# EAGLE design BLE112 Breakout Board v1.0 (EAGLE 5.11)
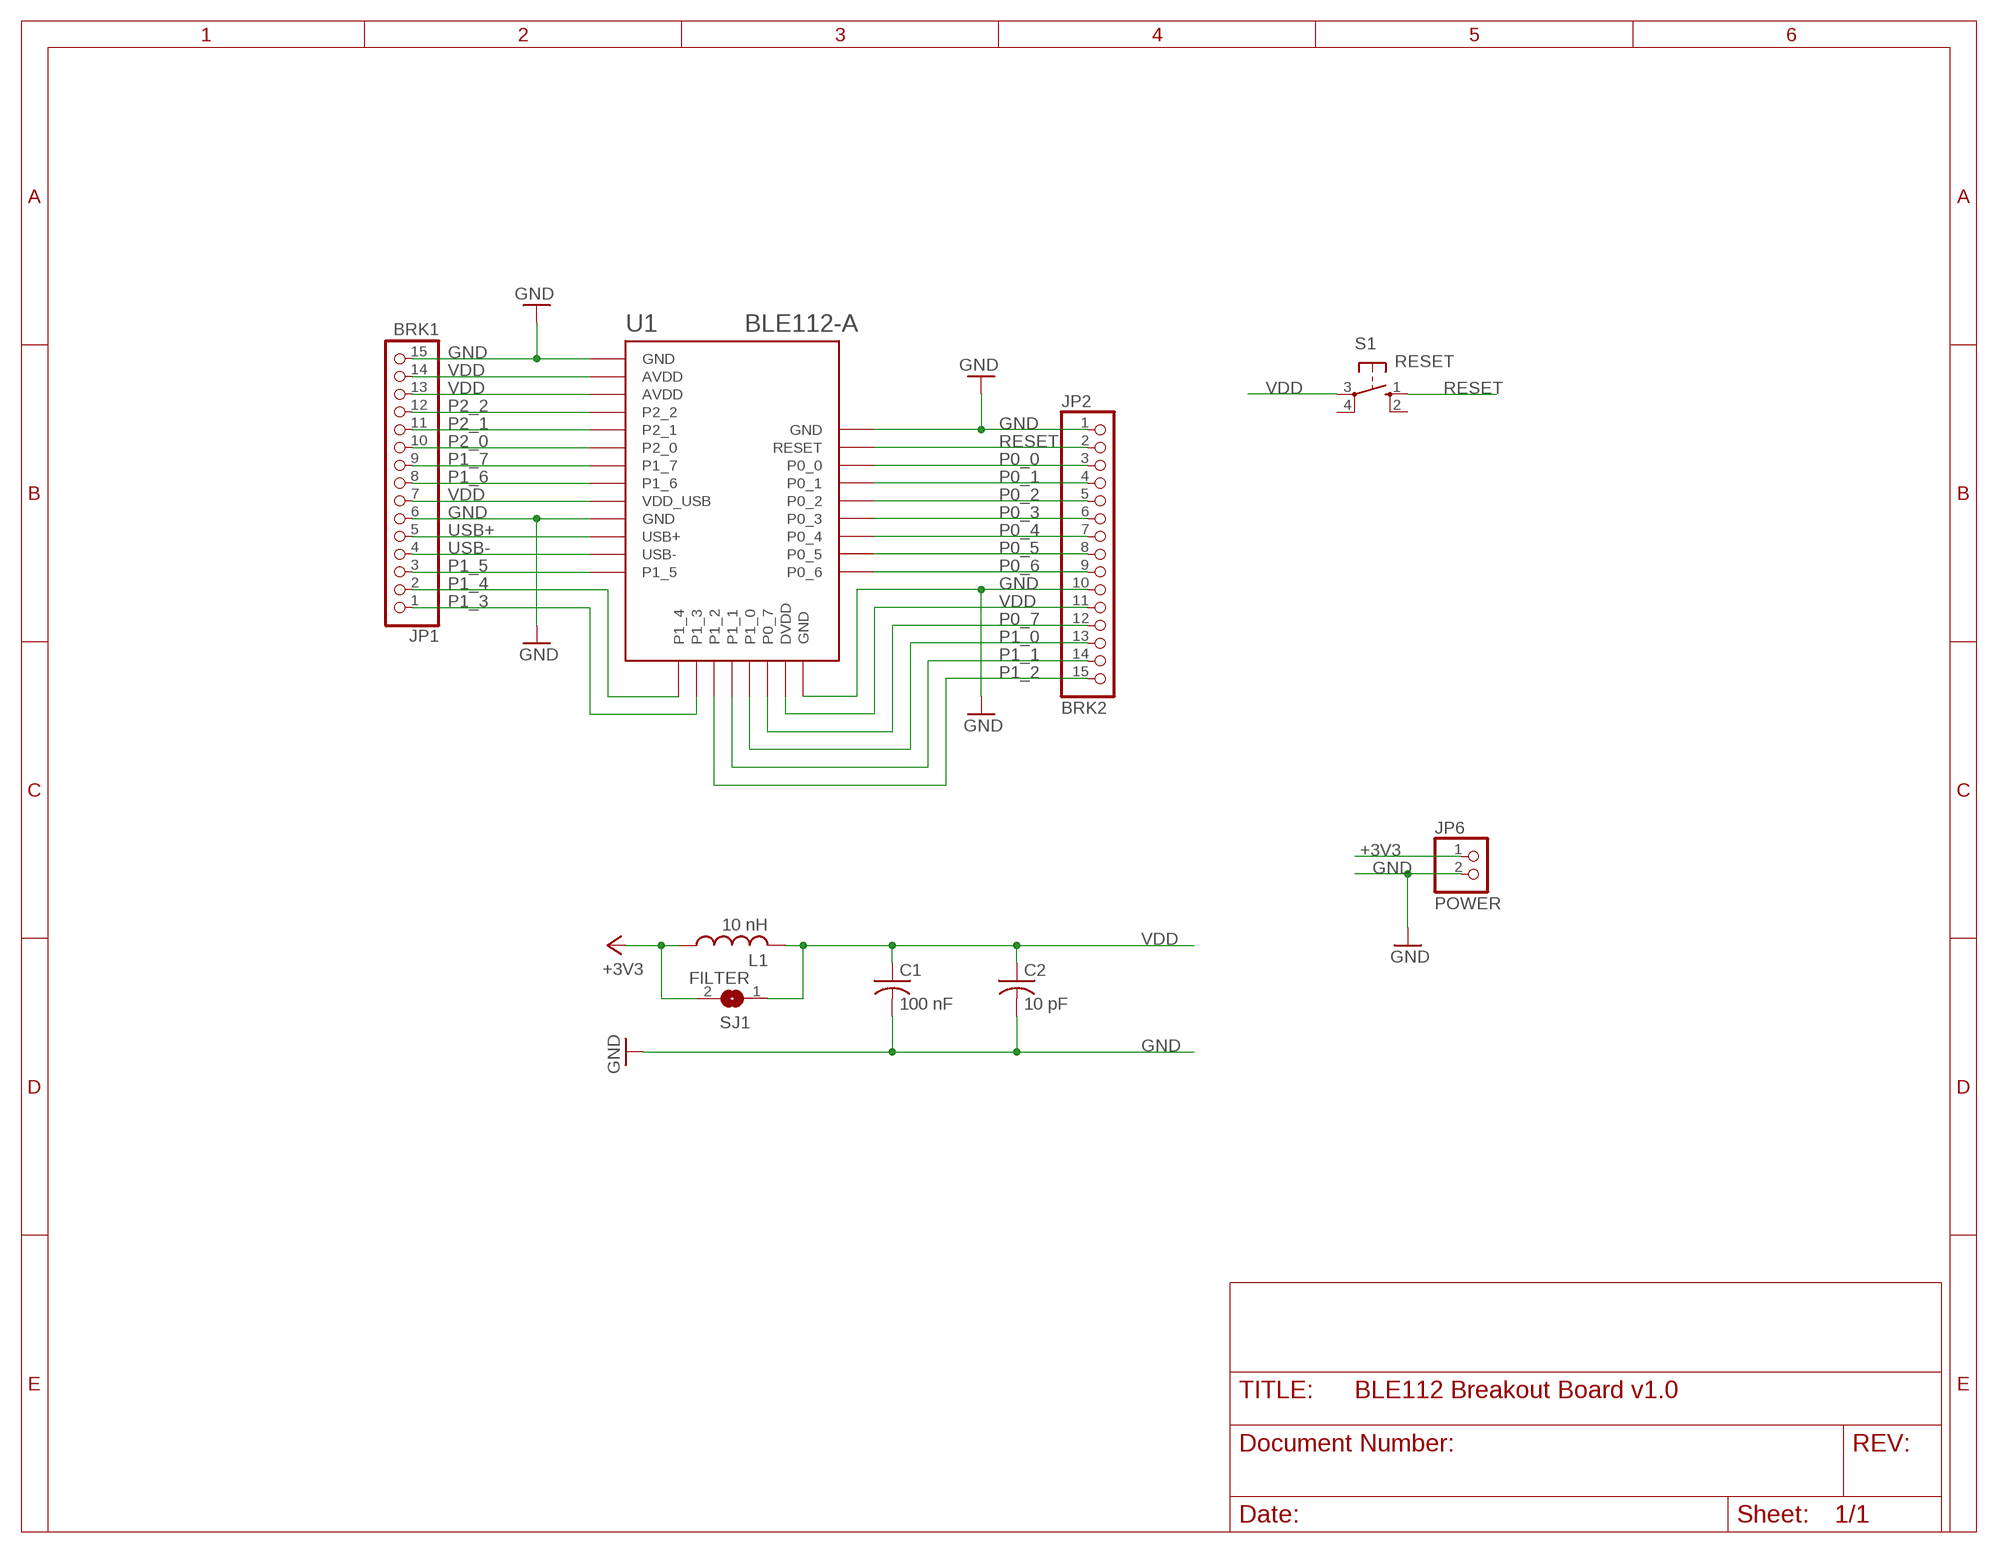
[diagram p0: schematic, sheet 1]

## Parts
C1  100 nF  C-US025-025X050  [C025-025X050]
C2  10 pF  C-US025-025X050  [C025-025X050]
JP1  BRK1  PINHD-1X15  [1X15]
JP2  BRK2  PINHD-1X15  [1X15]
JP6  POWER  PINHD-1X2  [1X02]
L1  10 nH  L-US0204/7  [0204/7]
S1  RESET  10-XX  [B3F-10XX]
SJ1  FILTER  SJ  [SJ]
U1  BLE112-A  BLE112-A-VISUAL  [BLE112-A]

## Nets
+3V3: JP6.1 L1.1 SJ1.2
GND: C1.2 C2.2 JP1.6 JP1.15 JP2.1 JP2.10 JP6.2 U1.GND1(GND) U1.GND2(GND) U1.GND3(GND) U1.GND4(GND)
P0_0: JP2.3 U1.P0_0
P0_1: JP2.4 U1.P0_1
P0_2: JP2.5 U1.P0_2
P0_3: JP2.6 U1.P0_3
P0_4: JP2.7 U1.P0_4
P0_5: JP2.8 U1.P0_5
P0_6: JP2.9 U1.P0_6
P0_7: JP2.12 U1.P0_7
P1_0: JP2.13 U1.P1_0
P1_1: JP2.14 U1.P1_1
P1_2: JP2.15 U1.P1_2
P1_3: JP1.1 U1.P1_3
P1_4: JP1.2 U1.P1_4
P1_5: JP1.3 U1.P1_5
P1_6: JP1.8 U1.P1_6
P1_7: JP1.9 U1.P1_7
P2_0: JP1.10 U1.P2_0
P2_1: JP1.11 U1.P2_1
P2_2: JP1.12 U1.P2_2
RESET: JP2.2 S1.1(S) U1.RESET
USB+: JP1.5 U1.USB+
USB-: JP1.4 U1.USB-
VDD: C1.1 C2.1 JP1.7 JP1.13 JP1.14 JP2.11 L1.2 S1.3(P) SJ1.1 U1.AVDD1(AVDD) U1.AVDD2(AVDD) U1.DVDD U1.VDD_USB
Unconnected: S1.2(S1) S1.4(P1)

## Library data of the parts
C1 C2 = resistor:C-US: CAPACITOR, American symbol
JP1 JP2 = sf-pinhead:PINHD-1X15: PIN HEADER
JP6 = sf-pinhead:PINHD-1X2: PIN HEADER
L1 = resistor:L-US: INDUCTOR, American symbol
S1 = switch-omron:10-XX: OMRON SWITCH; MPN: B3F-1000; OC_FARNELL: 176432; OC_NEWARK: 36M3542
SJ1 = jumper:SJ: SMD solder JUMPER
U1 = sf-bluegiga:BLE112-A-VISUAL: Bluetooth Low Energy single-mode module - Bluetooth 4.0, chip antenna

## Net classes
0 default: width 0.254 mm, drill 0.508 mm, clearance 0.254 mm

## Board
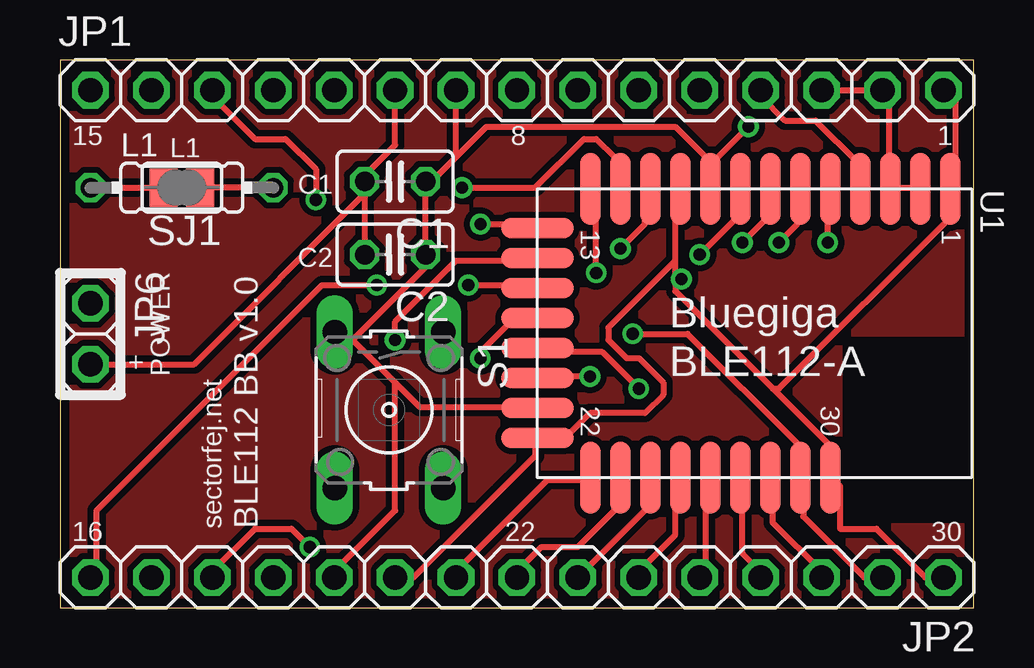
[diagram p1: board, top side]
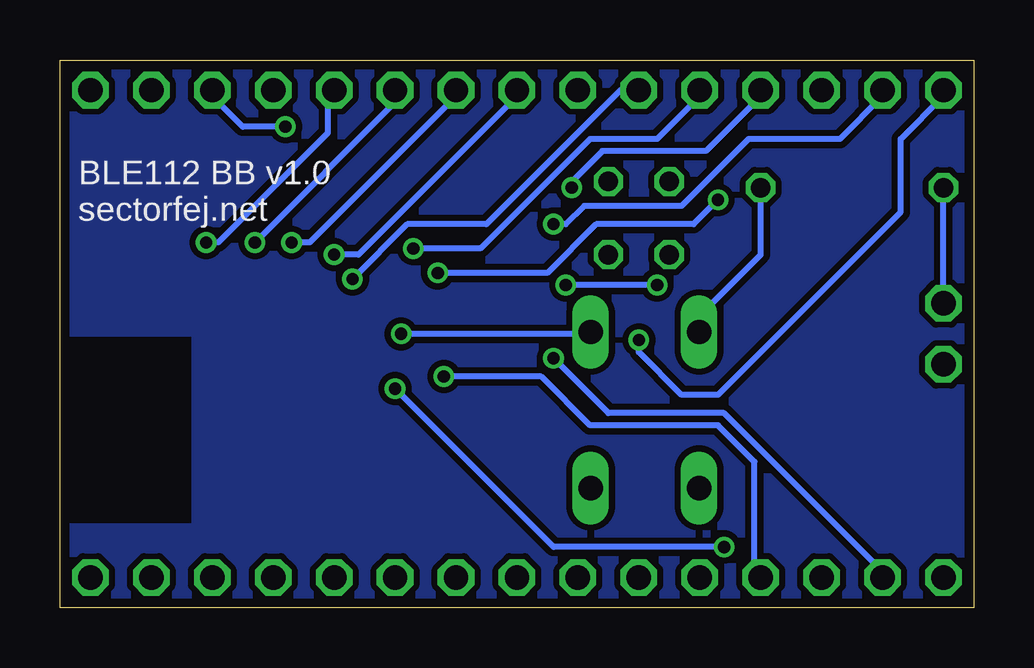
[diagram p2: board, bottom side, seen from below]

Size 38.1 x 22.85 mm. Coordinates in mm from the lower left corner, seen from the top.
Outline: 0,0 38.1,0 38.1,22.85 0,22.85 0,0
Copper layers (1*16): Top 0.0356mm / dielectric 1.5011mm / Bottom 0.0356mm
Design rules "LaenPCBOrder": minimum track width 6mil, minimum drill 13mil, track to track 6mil, track to pad 6mil, pad to pad 6mil, via to via 6mil, smd to smd 6mil, copper to edge 15mil, drill to drill 6mil, minimum pad ring 7mil, minimum via ring 7mil, stop-mask expansion 4mil, vias tented up to drill 0mil, thermal gap 10mil
tRestrict: area 32.6,3.6 to 38.1,11.3
bRestrict: area 32.6,3.6 to 38.1,11.3

### Footprints (pad centres in the part's own frame; a part is rotated, then mirrored left to right if it is on the bottom)
C025-025X050 = drill 0.813 octagon: 1 -1.27,0; 2 1.27,0
1X15 = drill 1.016 octagon: 1 -17.78,0; 2 -15.24,0; 3 -12.7,0; 4 -10.16,0; 5 -7.62,0; 6 -5.08,0; 7 -2.54,0; 8 0,0; 9 2.54,0; 10 5.08,0; 11 7.62,0; 12 10.16,0; 13 12.7,0; 14 15.24,0; 15 17.78,0
1X02 = drill 1.016 octagon: 1 -1.27,0; 2 1.27,0
0204/7 = drill 0.813 octagon: 1 -3.81,0; 2 3.81,0
B3F-10XX = drill 1.016 long: 1 -3.251,2.261; 2 3.251,2.261; 3 -3.251,-2.261; 4 3.251,-2.261
SJ = smd 1.168 x 1.6: 1 -0.762,0; 2 0.762,0
BLE112-A = smd 3 x 0.85: AVDD1 -6.05,6.9; AVDD2 -6.05,5.65; GND1 -6.05,8.15; GND2 -6.05,-3.1; GND4 6,3.15; P0_0 6,0.65; P0_1 6,-0.6; P0_2 6,-1.85; P0_3 6,-3.1; P0_4 6,-4.35; P0_5 6,-5.6; P0_6 6,-6.85; P1_5 -6.05,-6.85; P1_6 -6.05,-0.6; P1_7 -6.05,0.65; P2_0 -6.05,1.9; P2_1 -6.05,3.15; P2_2 -6.05,4.4; RESET 6,1.9; USB+ -6.05,-4.35; USB- -6.05,-5.6; VDD_USB -6.05,-1.85 | smd 0.85 x 3: DVDD 3.1,-9.05; GND3 4.35,-9.05; P0_7 1.85,-9.05; P1_0 0.6,-9.05; P1_1 -0.65,-9.05; P1_2 -1.9,-9.05; P1_3 -3.15,-9.05; P1_4 -4.4,-9.05

### Placement (x,y rotation side)
C1  13.97,17.78 180 top
C2  13.97,14.73 180 top
JP1  19.05,21.59 0 top
JP2  19.05,1.27 180 top
JP6  1.27,11.43 270 top
L1  5.08,17.53 0 top
S1  13.72,8.26 270 top
SJ1  5.08,17.53 180 top
U1  28.96,11.43 270 top

### Tracks (layer width: path | path; a pad name or v marks a point on that pad's centre or on a via)
+3V3
  Top 0.254: L1.1 SJ1.2
  Bottom 0.254: JP6.1 L1.1
GND  (via drill 0.51)
  Top 0.254: 12.7,17.27 C2.2 | JP6.2 5.59,10.16 12.7,17.27 | 12.7,17.27 C1.2 12.7,18.03 13.97,19.3 JP1.6 | JP2.10 14.73,1.27 19.81,6.35 19.81,6.86 U1.GND3 20.07,7.11 21.08,7.11 22.1,8.13 24.38,8.13 25.15,8.89 25.15,9.4 24.13,10.41 23.62,10.41 22.86,11.18 22.86,11.68 25.65,14.48 | JP1.15 37.34,21.08 37.34,17.53 U1.GND1 37.08,17.27 37.08,16.26 29.97,9.14 29.72,9.14 | 25.65,13.72 25.65,13.21 29.72,9.14 | 25.65,13.72 25.65,14.48 | 25.65,14.48 25.65,17.27 U1.GND2 | 29.72,9.14 32,6.86 32,5.59 U1.GND4 32.26,5.33 32.51,5.08 32.51,3.3 34.04,3.3 36.07,1.27 JP2.1 | v25.91,13.72 25.65,13.72
  Bottom 0.254: JP1.6 14.73,21.59 20.32,16 23.62,16 v25.91,13.72
GNDA
  pour Top: 0,22.86 38.1,22.86 38.1,0 0,0
GNDB
  pour Bottom: 0,22.86 38.1,22.86 38.1,0 0,0
P0_0
  Top 0.254: JP2.3 31.75,1.52 29.72,3.56 29.72,5.33 U1.P0_0
P0_1
  Top 0.254: JP2.4 29.21,1.52 28.45,2.29 28.45,5.33 U1.P0_1
P0_2
  Top 0.254: JP2.5 26.92,1.52 26.92,5.33 U1.P0_2
P0_3
  Top 0.254: JP2.6 24.13,1.52 25.65,3.05 25.65,5.33 U1.P0_3
P0_4
  Top 0.254: JP2.7 24.38,4.06 24.38,5.33 U1.P0_4
P0_5
  Top 0.254: JP2.8 19.05,1.52 20.07,2.54 21.59,2.54 23.11,4.06 23.11,5.33 U1.P0_5
P0_6
  Top 0.254: JP2.9 16.51,1.52 20.32,5.33 22.1,5.33 U1.P0_6
P0_7  (via drill 0.51)
  Top 0.254: v22.1,9.65 20.07,9.65 U1.P0_7
  Bottom 0.254: v22.1,9.65 18.03,9.65 16,7.62 10.67,7.62 9.14,6.1 9.14,1.52 JP2.12
P1_0  (via drill 0.51)
  Top 0.254: v24.13,9.14 22.61,10.67 20.07,10.67 U1.P1_0 | v10.41,2.54 9.65,3.3 8.13,3.3 6.35,1.52 JP2.13
  Bottom 0.254: v24.13,9.14 17.53,2.54 v10.41,2.54
P1_1  (via drill 0.51)
  Top 0.254: v17.53,10.41 17.53,10.67 18.8,11.94 19.81,11.94 U1.P1_1
  Bottom 0.254: v17.53,10.41 15.24,8.13 10.41,8.13 3.81,1.52 JP2.14
P1_2  (via drill 0.51)
  Top 0.254: v17.02,13.46 19.81,13.46 U1.P1_2 | v13.21,13.46 10.92,13.46 1.52,4.06 1.52,1.52 JP2.15
  Bottom 0.254: v13.21,13.46 v17.02,13.46
P1_3  (via drill 0.51)
  Top 0.254: v13.97,11.18 13.97,11.94 16.51,14.48 19.81,14.48 U1.P1_3
  Bottom 0.254: v13.97,11.18 13.97,10.67 12.19,8.89 10.67,8.89 3.05,16.51 3.05,19.56 1.27,21.34 JP1.1
P1_4  (via drill 0.51)
  Top 0.254: v17.53,16 19.81,16 U1.P1_4
  Bottom 0.254: v17.53,16 17.02,16 16.26,16.76 12.19,16.76 9.4,19.56 5.59,19.56 3.81,21.34 JP1.2
P1_5  (via drill 0.51)
  Top 0.254: v22.35,13.97 22.35,17.27 U1.P1_5 | v10.67,17.02 10.67,18.29 9.4,19.56 8.13,19.56 6.35,21.34 JP1.3
  Bottom 0.254: v22.35,13.97 17.78,13.97 15.75,16 11.68,16 v10.67,17.02
P1_6  (via drill 0.51)
  Top 0.254: v26.67,14.73 28.19,16.26 28.19,17.27 U1.P1_6
  Bottom 0.254: v26.67,14.73 25.65,14.73 19.05,21.34 JP1.8
P1_7  (via drill 0.51)
  Top 0.254: v28.45,15.24 29.46,16.26 29.46,17.27 U1.P1_7
  Bottom 0.254: v28.45,15.24 27.69,15.24 21.59,21.34 JP1.9
P2_0  (via drill 0.51)
  Top 0.254: v29.97,15.24 30.73,16 30.73,17.27 U1.P2_0
  Bottom 0.254: v29.97,15.24 24.13,21.08 JP1.10
P2_1  (via drill 0.51)
  Top 0.254: v32,15.24 32,17.27 U1.P2_1
  Bottom 0.254: v32,15.24 31.5,15.24 26.92,19.81 26.92,21.34 JP1.11
P2_2
  Top 0.254: JP1.12 29.21,21.34 30.23,20.32 31.5,20.32 33.27,18.54 33.27,17.53 U1.P2_2
RESET  (via drill 0.51)
  Top 0.254: JP2.2 33.53,1.27 30.99,3.81 30.99,5.33 U1.RESET 30.73,5.59 30.73,6.86 26.16,11.43 v23.88,11.43
  Bottom 0.254: v23.88,11.43 16,11.43 S1.1
USB+  (via drill 0.51)
  Top 0.254: v23.37,14.99 24.38,16 24.38,17.27 U1.USB+
  Bottom 0.254: v23.37,14.99 20.57,14.99 16,19.56 13.21,19.56 11.43,21.34 JP1.5
USB-  (via drill 0.51)
  Top 0.254: v16.76,17.53 19.81,17.53 21.84,19.56 22.35,19.56 23.11,18.8 23.11,17.53 U1.USB-
  Bottom 0.254: v16.76,17.53 16.76,17.78 15.49,19.05 11.18,19.05 8.89,21.34 JP1.4
VDD  (via drill 0.51)
  Top 0.254: U1.AVDD1 35.81,17.53 34.8,17.53 U1.AVDD2 34.54,17.53 34.54,21.34 JP1.14 JP1.13 | 27.18,18.54 27.18,17.53 U1.VDD_USB 27.18,18.54 | 27.18,18.54 v28.7,20.07 | 15.24,17.53 C2.1 15.24,14.22 12.19,11.18 | 16.51,18.8 JP1.7 | 15.24,17.53 16.51,18.8 | 15.24,17.53 C1.1 | L1.2 SJ1.1 | 12.19,11.18 11.68,11.68 S1.3 12.19,11.18 | 13.97,9.4 12.19,11.18 | 13.97,9.4 14.99,8.38 19.81,8.38 U1.DVDD | JP2.11 11.43,1.52 13.97,4.06 13.97,9.4 | 27.18,18.54 25.65,20.07 17.78,20.07 16.51,18.8
  Bottom 0.254: v28.7,20.07 30.48,20.07 31.75,21.34 JP1.13 | L1.2 8.89,14.73 11.43,12.19 11.43,11.68 S1.3

### Text on the board
tPlace: 15 | L1 | 8 | 1 | C1 | C2 | - | Bluegiga | + | POWER | BLE112-A | 16 | sectorfej.net | BLE112 BB v1.0 | 22 | 30
bPlace: BLE112 BB v1.0 | sectorfej.net